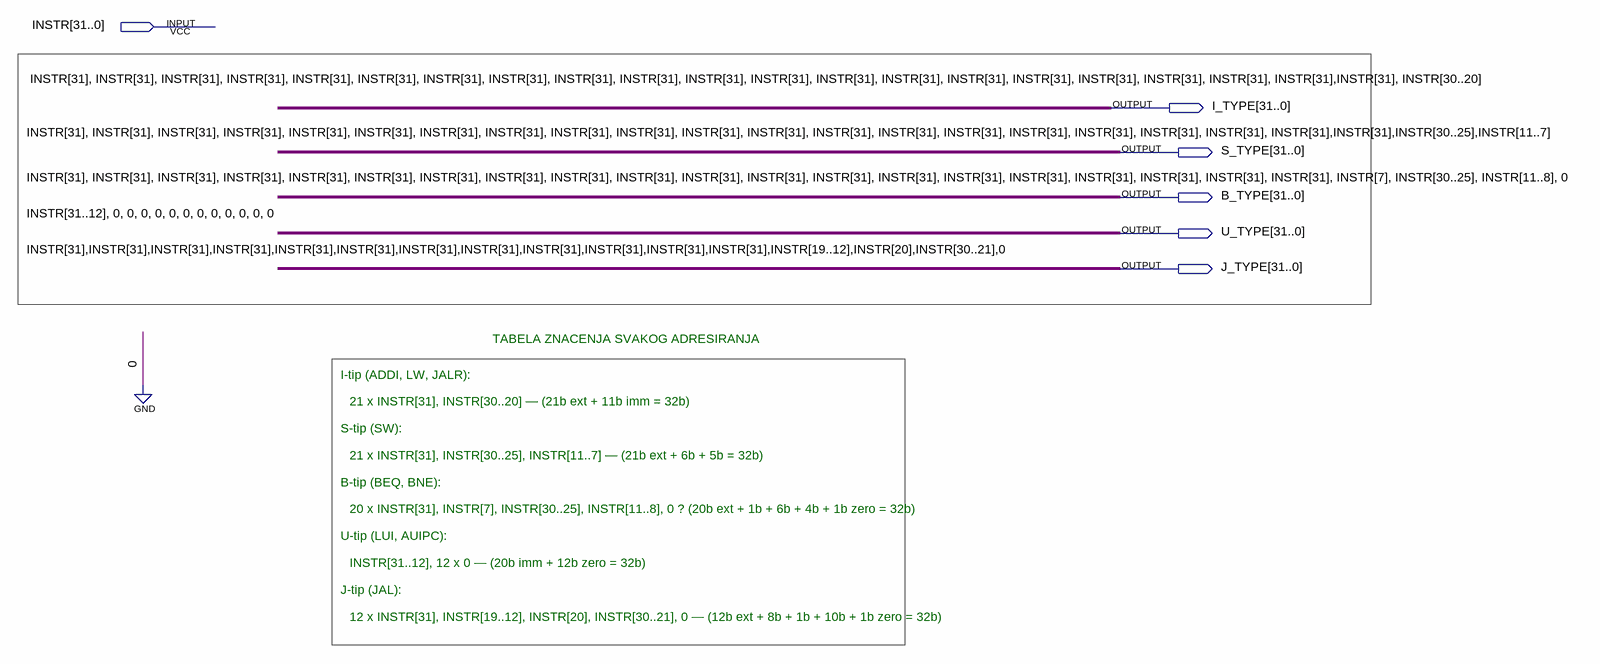
[diagram p0: schematic sheet]
// Quartus schematic ImmediateGenTypes.bdf as structural Verilog: 0 symbols, 6 pins
module ImmediateGenTypes (
  input  [31:0] INSTR,
  output [31:0] I_TYPE,
  output [31:0] S_TYPE,
  output [31:0] B_TYPE,
  output [31:0] U_TYPE,
  output [31:0] J_TYPE
);


  assign B_TYPE = {{20{INSTR[31]}}, INSTR[7], INSTR[30:25], INSTR[11:8], 1'b0};
  assign I_TYPE = {{21{INSTR[31]}}, INSTR[30:20]};
  assign J_TYPE = {{12{INSTR[31]}}, INSTR[19:12], INSTR[20], INSTR[30:21], 1'b0};
  assign S_TYPE = {{21{INSTR[31]}}, INSTR[30:25], INSTR[11:7]};
  assign U_TYPE = {INSTR[31:12], {12{1'b0}}};

  // Notes on the sheet:
  //   TABELA ZNACENJA SVAKOG ADRESIRANJA
  //   I-tip (ADDI, LW, JALR):
  //   21 x INSTR[31], INSTR[30..20] — (21b ext + 11b imm = 32b)
  //   S-tip (SW):
  //   21 x INSTR[31], INSTR[30..25], INSTR[11..7] — (21b ext + 6b + 5b = 32b)
  //   B-tip (BEQ, BNE):
  //   20 x INSTR[31], INSTR[7], INSTR[30..25], INSTR[11..8], 0 ? (20b ext + 1b + 6b + 4b + 1b zero = 32b)
  //   U-tip (LUI, AUIPC):
  //   INSTR[31..12], 12 x 0 — (20b imm + 12b zero = 32b)
  //   J-tip (JAL):
  //   12 x INSTR[31], INSTR[19..12], INSTR[20], INSTR[30..21], 0 — (12b ext + 8b + 1b + 10b + 1b zero = 32b)
endmodule
